# Altium project GPSDO.PrjPcb
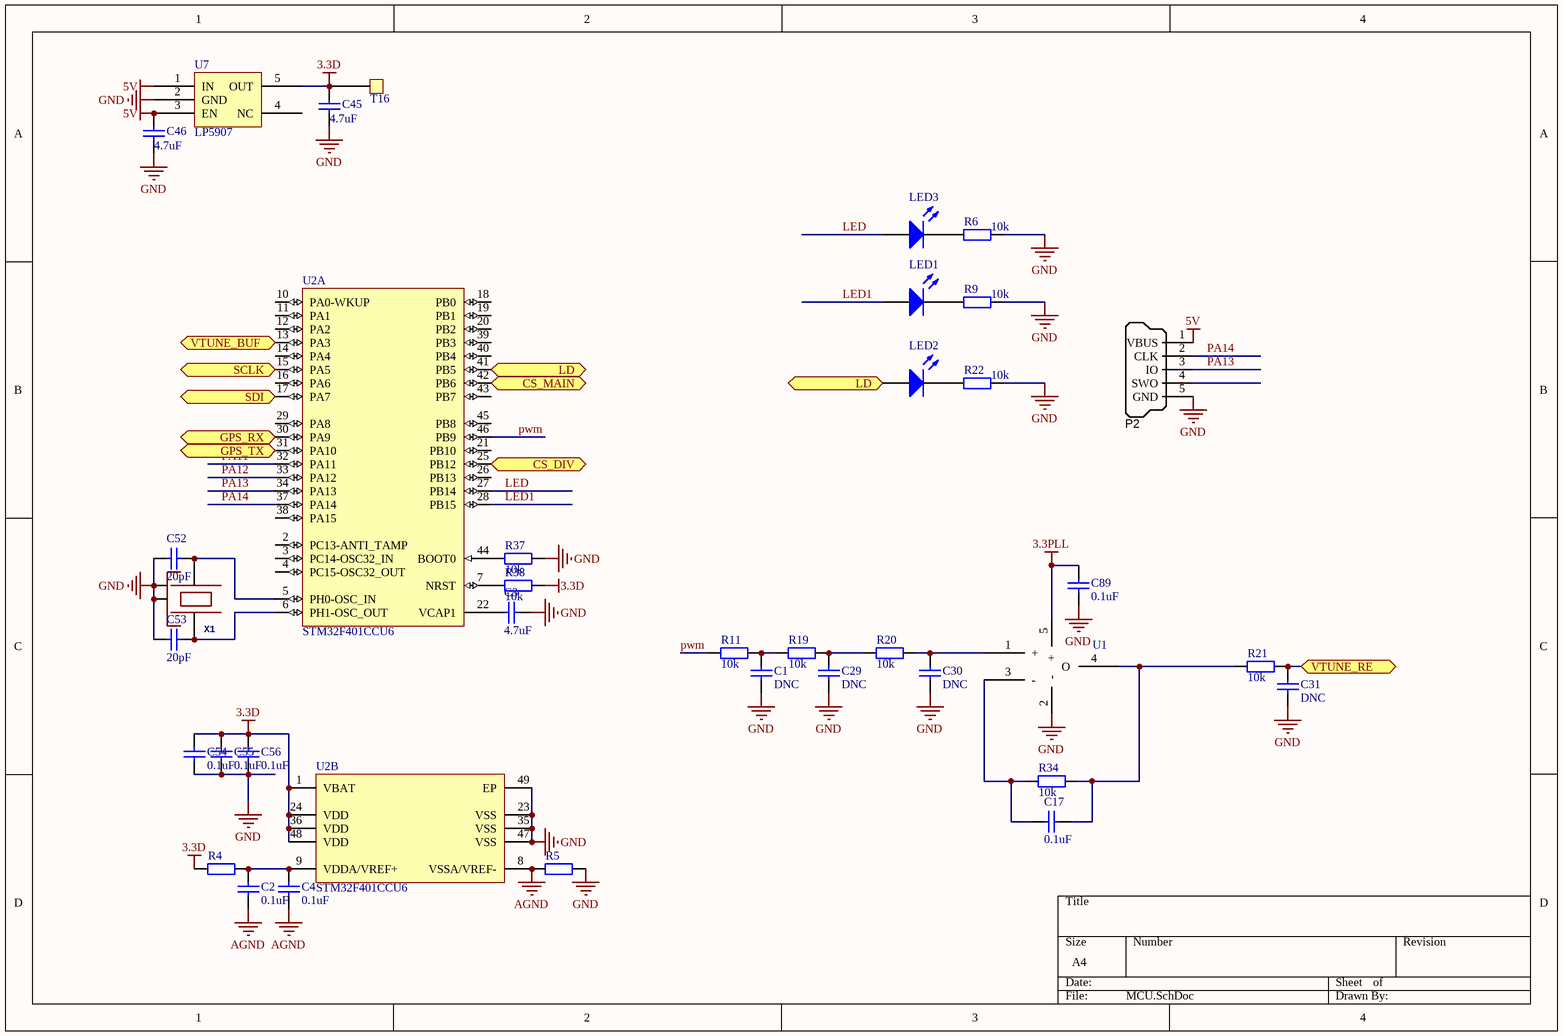
[diagram p0: MCU.SchDoc]
3 sheets, 90 parts. Net scope: flat (ports and power ports of the same name join across sheets).
Board file: GPSDO.PcbDoc
Sheets:
  MCU.SchDoc
  GPS.SchDoc
  PLL.SchDoc

## Sheet MCU.SchDoc
size A4

### Parts
C1  value DNC  [0402]  (hidden comment: Cap)
C2  value 0.1uF  [0402]  (hidden comment: Cap)
C3  value 4.7uF  [0603]  (hidden comment: Cap)
C4  value 0.1uF  [0402]  (hidden comment: Cap)
C17  value 0.1uF  [0402]  (hidden comment: Cap)
C29  value DNC  [0402]  (hidden comment: Cap)
C30  value DNC  [0402]  (hidden comment: Cap)
C31  value DNC  [0402]  (hidden comment: Cap)
C45  4.7uF  [0603]
C46  4.7uF  [0603]
C52  value 20pF  [0402]  (hidden comment: Cap)
C53  value 20pF  [0402]  (hidden comment: Cap)
C54  value 0.1uF  [0402]  (hidden comment: Cap)
C55  value 0.1uF  [0402]  (hidden comment: Cap)
C56  value 0.1uF  [0402]  (hidden comment: Cap)
C89  value 0.1uF  [0402]  (hidden comment: Cap)
LED1  LED0  [0603]  (value not drawn)
LED2  LED0  [0603]  (value not drawn)
LED3  LED0  [0603]  (value not drawn)
P2  SWD_MicroUSB  [MICRO-YZX]  (value not drawn)
R4  0R/FB  [0402]  (value not drawn)
R5  0R/FB  [0402]  (value not drawn)
R6  10k  [0402]
R9  10k  [0402]
R11  value 10k  [0402]  (hidden comment: Res2)
R19  value 10k  [0402]  (hidden comment: Res2)
R20  value 10k  [0402]  (hidden comment: Res2)
R21  value 10k  [0402]  (hidden comment: Res2)
R22  10k  [0402]
R34  value 10k  [0402]  (hidden comment: Res2)
R37  value 10k  [0402]  (hidden comment: Res2)
R38  value 10k  [0402]  (hidden comment: Res2)
T16  TestPad  [TestPad - 1mm]  (value not drawn)
U1  OP-SOT23  [SOT23-5]  (value not drawn)
U2  STM32F401CCU6  [STM-UFQFPN48_N]  (parts A,B of 2)
U7  LP5907  [SOT23-5]
X1  24.000 KHz 3.2x2.5mm 8-10pf  [OSCILLATOR-3.2X2.5]  (value not drawn)

### Ports
CS_DIV, CS_MAIN, GPS_RX, GPS_TX, LD, SCLK, SDI, VTUNE_BUF, VTUNE_RE

### Nets
3.3D: C45.2 C54.2 C55.2 C56.2 R4.2 R38.1 T16.1 U2.1(VBAT) U2.24(VDD) U2.36(VDD) U2.48(VDD) U7.5(OUT)
3.3PLL: C89.2 U1.5(+)
5V: C46.2 P2.1(VBUS) U7.1(IN) U7.3(EN)
AGND: C2.1 C4.1 R5.2 U2.8(VSSA/VREF-)
GND: C1.2 C3.1 C29.2 C30.2 C31.2 C45.1 C46.1 C52.1 C53.1 C54.1 C55.1 C56.1 C89.1 P2.5(GND) R5.1 R6.2 R9.2 R22.2 R37.2 U1.2(-) U2.23(VSS) U2.35(VSS) U2.47(VSS) U2.49(EP) U7.2(GND) X1.2(NC_2) X1.4(NC_4)
LED: LED3.1(A) U2.27(PB14)
LED1: LED1.1(A) U2.28(PB15)
PA11: U2.32(PA11)
PA12: U2.33(PA12)
PA13: P2.3(IO) U2.34(PA13)
PA14: P2.2(CLK) U2.37(PA14)
pwm: R11.2 U2.46(PB9)
NetC1_1: C1.1 R11.1 R19.2
NetC2_2: C2.2 C4.2 R4.1 U2.9(VDDA/VREF+)
NetC3_2: C3.2 U2.22(VCAP1)
NetC17_1: C17.1 R34.2 U1.3(-)
NetC17_2: C17.2 R21.2 R34.1 U1.4(O)
NetC19_1: C31.1 R21.1 ; port VTUNE_RE
NetC28_2: U2.13(PA3) ; port VTUNE_BUF
NetC29_1: C29.1 R19.1 R20.2
NetC30_1: C30.1 R20.1 U1.1(+)
NetC52_2: C52.2 U2.5(PH0-OSC_IN) X1.1
NetC53_2: C53.2 U2.6(PH1-OSC_OUT) X1.3
NetLED1_2: LED1.2(K) R9.1
NetLED2_1: LED2.1(A) U2.41(PB5) ; port LD
NetLED2_2: LED2.2(K) R22.1
NetLED3_2: LED3.2(K) R6.1
NetR37_1: R37.1 U2.44(BOOT0)
NetR38_2: R38.2 U2.7(NRST)
NetU2_15: U2.15(PA5) ; port SCLK
NetU2_17: U2.17(PA7) ; port SDI
NetU2_25: U2.25(PB12) ; port CS_DIV
NetU2_30: U2.30(PA9) ; port GPS_RX
NetU2_31: U2.31(PA10) ; port GPS_TX
NetU2_42: U2.42(PB6) ; port CS_MAIN

Not connected (* = marked no-connect by the designer): P2 4(SWO); U2 2(PC13-ANTI_TAMP) 3(PC14-OSC32_IN) 4(PC15-OSC32_OUT) 10(PA0-WKUP) 11(PA1) 12(PA2) 14(PA4) 16(PA6) 18(PB0) 19(PB1) 20(PB2) 21(PB10) 26(PB13) 29(PA8) 38(PA15) 39(PB3) 40(PB4) 43(PB7) 45(PB8); U7 4(NC)

### Library data of the parts
C1-C4 C17 C29-C31 C45 C46 C52-C56 C89 = Cap: Capacitor; Published: 8-Jun-2000; LatestRevisionDate: 17-Jul-2002; LatestRevisionNote: Re-released for DXP Platform.; PackageReference: RAD-0.3; Publisher: Altium Limited; PackageDescription: Radial Cap, Thru-Hole; 2 Leads; 0.3 in Pin Spacing
LED1-LED3 = LED0: Typical INFRARED GaAs LED; Published: 8-Jun-2000; LatestRevisionDate: 08-Jul-2005; LatestRevisionNote: Mech Layer 1 removed.; PackageReference: LED-0; Publisher: Altium Limited; PackageDescription: LED; 2 Leads
P2 = SWD_MicroUSB: Connector SMD USB Micro Type B middle mount; Manufacturer 1: Molex Inc; SCDType: undef; Package / Case: SMD; Supplier 1: Digi-Key; Supplier Part Number 1: WM17142CT-ND
R4 R5 R11 R19-R21 R34 R37 R38 = Res2: Resistor; Published: 8-Jun-2000; LatestRevisionDate: 17-Jul-2002; LatestRevisionNote: Re-released for DXP Platform.; PackageReference: AXIAL-0.4; Publisher: Altium Limited; PackageDescription: Axial Device, Thru-Hole; 2 Leads; 0.4 in Pin Spacing
R6 R9 R22 = Res2: Resistor; Value: 0Ohm; Published: 8-Jun-2000; LatestRevisionDate: 17-Jul-2002; LatestRevisionNote: Re-released for DXP Platform.; PackageReference: AXIAL-0.4; Publisher: Altium Limited; PackageDescription: Axial Device, Thru-Hole; 2 Leads; 0.4 in Pin Spacing
U2 = STM32F401CCU6: ARM Cortex-M4 32-bit MCU+FPU, 105 DMIPS, 256 kB Flash, 64 kB Internal RAM, 36 I/Os, 48-pin UFQFPN, -40 to 85 degC, Tray; Manufacturer: STMicroelectronics; FLASH Size (Prog) (kB): 256; I/Os (High Current): 36; Internal RAM Size (kB): 64; Operating Frequency(F) (Processor speed) (MHz): 84; Supply Voltage(Vcc) max (V): 3.6; Supply Voltage(Vcc) min (V): 1.8; DatasheetVersion: Rev. 1; PackageVersion: Rev. 1, 04/2013; PackageReference: UFQFPN48; PackageDescription: 48-Pin Ultra Thin Fine Pitch Quad Flat No-Lead, 7 x 7 x 0.6 mm Body, 0.5 mm Pitch, Exposed Pad; Supplier 1: Newark; Supplier Part Number 1: 19X6217; Supplier 2: Mouser; Supplier Part Number 2: 511-STM32F401CCU6; Core: ARM Cortex-M4; Packing: Tray; Mounting Technology: Surface Mount; PartNumber: STM32F401CCU6; ComponentLink1Description: Manufacturer URL; ComponentLink1URL: http://www.st.com/web/en/home.html; ComponentLink2Description: Datasheet; ComponentLink2URL: http://www.st.com/st-web-ui/static/active/en/resource/technical/document/data_brief/DM00071938.pdf; ComponentLink3Description: Package Specification; ComponentLink3URL: http://www.st.com/st-web-ui/static/active/en/resource/technical/document/data_brief/DM00071938.pdf
X1 = OSCILLATOR-3.2X2.5: Crystal Oscillator in 3.2x2.5 SMD

## Sheet GPS.SchDoc
size A4
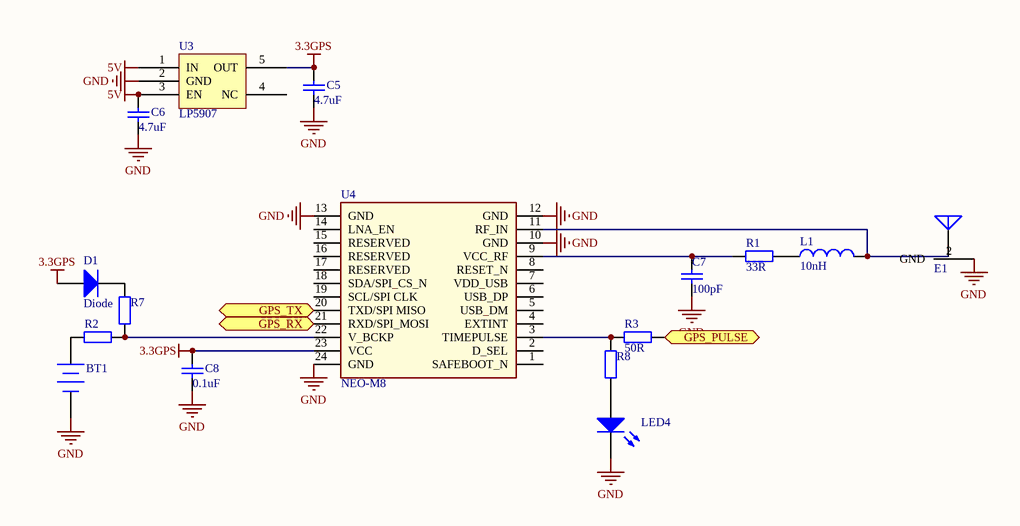
[diagram p1: GPS.SchDoc]

### Parts
BT1  Battery  [XH414H-IV01E]  (value not drawn)
C5  4.7uF  [0603]
C6  4.7uF  [0603]
C7  100pF  [0402]
C8  0.1uF  [0402]
D1  Diode  [LC-SOD-323]
E1  Antenna  [IPEX]  (value not drawn)
L1  10nH  [0402]
LED4  LED0  [0603]  (value not drawn)
R1  33R  [0402]
R2  (no value)  [0402]
R3  50R  [0402]
R7  (no value)  [0402]
R8  (no value)  [0402]
U3  LP5907  [SOT23-5]
U4  NEO-M8  [NEO]

### Ports
GPS_PULSE, GPS_RX, GPS_TX

### Nets
3.3GPS: C5.2 C8.2 D1.1(A) U3.5(OUT) U4.23(VCC)
5V: C6.2 U3.1(IN) U3.3(EN)
GND: BT1.2(-) C5.1 C6.1 C7.1 C8.1 E1.2(GND) LED4.2(K) U3.2(GND) U4.10(GND) U4.12(GND) U4.13(GND) U4.24(GND)
NetBT1_1: BT1.1(+) R2.1
NetC7_2: C7.2 R1.1 U4.9(VCC_RF)
NetC14_1: R3.1 ; port GPS_PULSE
NetD1_2: D1.2(K) R7.1
NetE1_1: E1.1(ANT) L1.2 U4.11(RF_IN)
NetL1_1: L1.1 R1.2
NetLED4_1: LED4.1(A) R8.2
NetR2_2: R2.2 R7.2 U4.22(V_BCKP)
NetR3_2: R3.2 R8.1 U4.3(TIMEPULSE)
NetU2_30: U4.21(RXD/SPI_MOSI) ; port GPS_RX
NetU2_31: U4.20(TXD/SPI_MISO) ; port GPS_TX

Not connected (* = marked no-connect by the designer): U3 4(NC); U4 1(SAFEBOOT_N) 2(D_SEL) 4(EXTINT) 5(USB_DM) 6(USB_DP) 7(VDD_USB) 8(RESET_N) 14(LNA_EN) 15(RESERVED) 16(RESERVED) 17(RESERVED) 18(SDA/SPI_CS_N) 19(SCL/SPI_CLK)

### Library data of the parts
BT1 = Battery: Multicell Battery; Published: 24-Mar-1999; LatestRevisionDate: 17-Jul-2002; LatestRevisionNote: Re-released for DXP Platform.; PackageReference: BAT-2; Publisher: Altium Limited; PackageDescription: Battery; 2 Leads
C5-C8 = Cap: Capacitor; Published: 8-Jun-2000; LatestRevisionDate: 17-Jul-2002; LatestRevisionNote: Re-released for DXP Platform.; PackageReference: RAD-0.3; Publisher: Altium Limited; PackageDescription: Radial Cap, Thru-Hole; 2 Leads; 0.3 in Pin Spacing
D1 = Diode: Default Diode; Published: 8-Jun-2000; LatestRevisionDate: 17-Jul-2002; LatestRevisionNote: Re-released for DXP Platform.; PackageVersion: Sep-1996; PackageReference: SMC; Publisher: Altium Limited; PackageDescription: DO-214-AB/SMC; 2 C-Bend Leads; Body 7.9 x 5.9 mm, inc. leads (LxW); Code_JEDEC: DO-214-AB
E1 = Antenna: Generic Antenna; Published: 24-Mar-1999; LatestRevisionDate: 17-Jul-2002; LatestRevisionNote: Re-released for DXP Platform.; PackageReference: PIN1; Publisher: Altium Limited
L1 = Inductor: Code_IEC: 1005; Value: 10mH; Published: 8-Jun-2000; LatestRevisionDate: 29-May-2009; LatestRevisionNote: IPC-7351 Footprint Added.; PackageReference: 0402-A; Publisher: Altium Limited; PackageDescription: Chip Inductor; Code_JEITA: 0402
LED4 = LED0: Typical INFRARED GaAs LED; Published: 8-Jun-2000; LatestRevisionDate: 08-Jul-2005; LatestRevisionNote: Mech Layer 1 removed.; PackageReference: LED-0; Publisher: Altium Limited; PackageDescription: LED; 2 Leads
R1 R3 = Res2: Resistor; Published: 8-Jun-2000; LatestRevisionDate: 17-Jul-2002; LatestRevisionNote: Re-released for DXP Platform.; PackageReference: AXIAL-0.4; Publisher: Altium Limited; PackageDescription: Axial Device, Thru-Hole; 2 Leads; 0.4 in Pin Spacing
R2 R7 R8 = Res2: Resistor; Value: 0R; Published: 8-Jun-2000; LatestRevisionDate: 17-Jul-2002; LatestRevisionNote: Re-released for DXP Platform.; PackageReference: AXIAL-0.4; Publisher: Altium Limited; PackageDescription: Axial Device, Thru-Hole; 2 Leads; 0.4 in Pin Spacing
U4 = NEO: u-blox NEO GNSS module; Part Description: u-blox GNSS module; Manufacturer: u-blox; Value: NEO-M8

## Sheet PLL.SchDoc
size A4
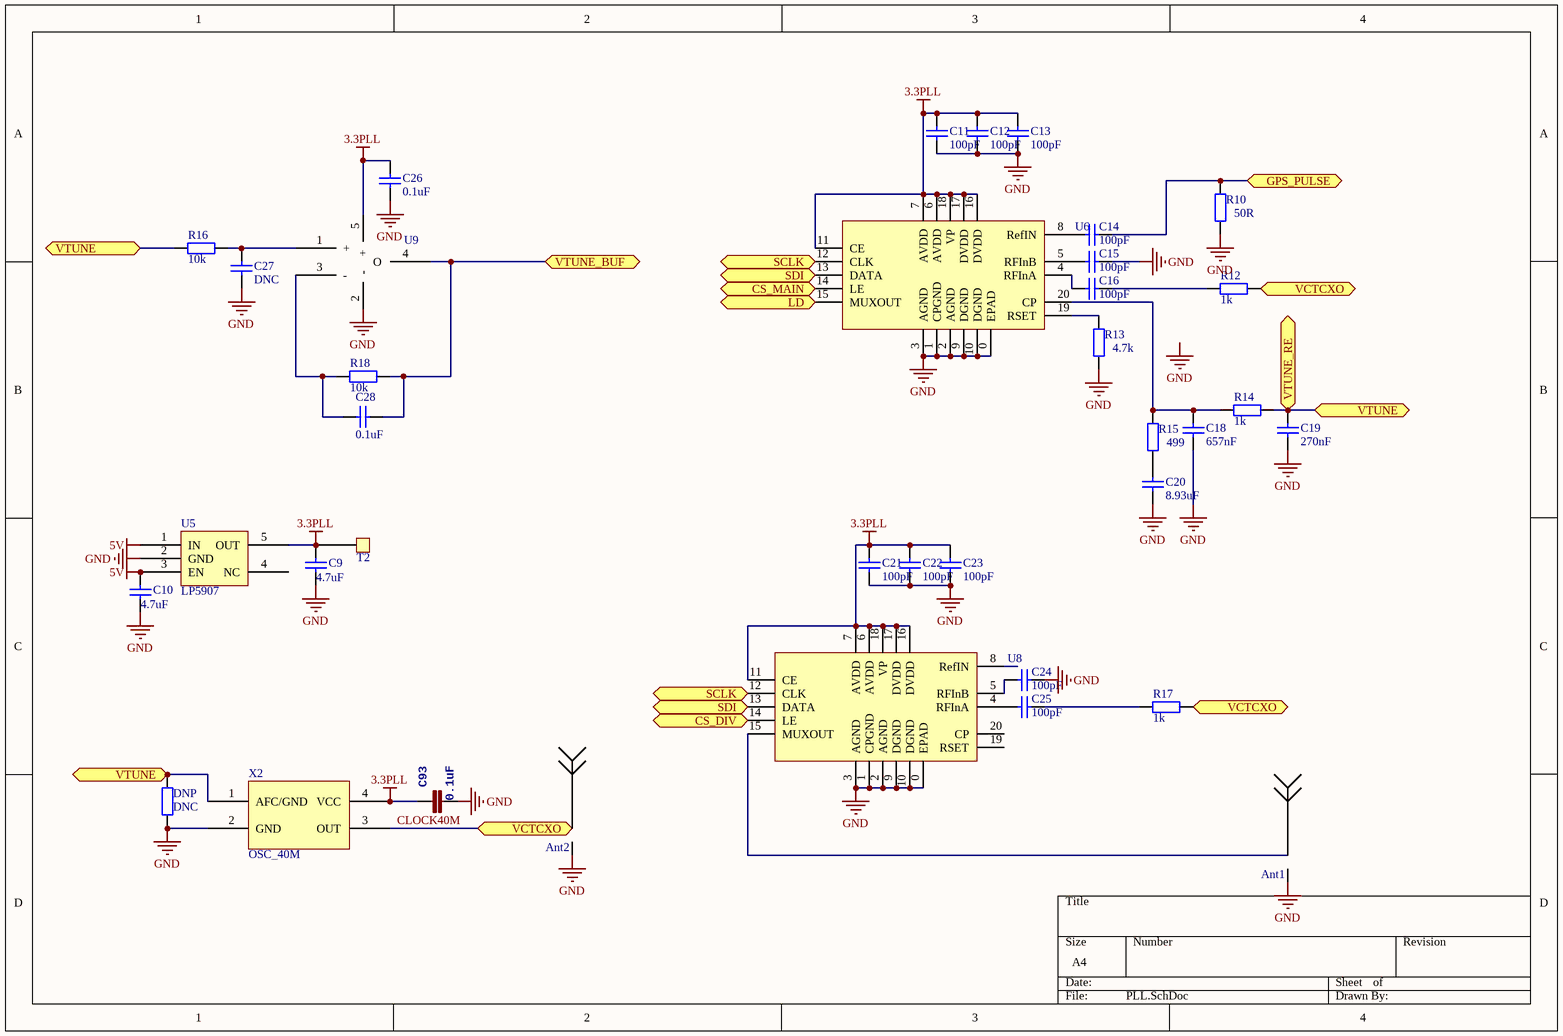
[diagram p2: PLL.SchDoc]

### Parts
Ant1  Antenna  [SMA-2]  (value not drawn)
Ant2  Antenna  [SMA-2]  (value not drawn)
C9  4.7uF  [0603]
C10  4.7uF  [0603]
C11  100pF  [0402]
C12  100pF  [0402]
C13  100pF  [0402]
C14  100pF  [0402]
C15  100pF  [0402]
C16  100pF  [0402]
C18  657nF  [0402]
C19  270nF  [0402]
C20  8.93uF  [0402]
C21  100pF  [0402]
C22  100pF  [0402]
C23  100pF  [0402]
C24  100pF  [0402]
C25  100pF  [0402]
C26  value 0.1uF  [0402]  (hidden comment: Cap)
C27  value DNC  [0402]  (hidden comment: Cap)
C28  value 0.1uF  [0402]  (hidden comment: Cap)
C93  0.1uF  [0402]
DNP  DNC  [0402]
R10  50R  [0402]
R12  1k  [0402]
R13  4.7k  [0402]
R14  1k  [0402]
R15  499  [0402]
R16  value 10k  [0402]  (hidden comment: Res2)
R17  1k  [0402]
R18  value 10k  [0402]  (hidden comment: Res2)
T2  TestPad  [TestPad - 1mm]  (value not drawn)
U5  LP5907  [SOT23-5]
U6  ADF4001  [ADF4001]  (value not drawn)
U8  ADF4001  [ADF4001]  (value not drawn)
U9  OP-SOT23  [SOT23-5]  (value not drawn)
X2  OSC_40M  [TXC_7Q]

### Ports
CS_DIV, CS_MAIN, GPS_PULSE, LD, SCLK, SDI, VCTCXO, VTUNE, VTUNE_BUF, VTUNE_RE

### Nets
3.3PLL: C9.2 C11.1 C12.1 C13.1 C21.1 C22.1 C23.1 C26.2 C93.1 T2.1 U5.5(OUT) U6.6(AVDD) U6.7(AVDD) U6.11(CE) U6.16(DVDD) U6.17(DVDD) U6.18(VP) U8.6(AVDD) U8.7(AVDD) U8.11(CE) U8.16(DVDD) U8.17(DVDD) U8.18(VP) U9.5(+) X2.4(VCC)
5V: C10.2 U5.1(IN) U5.3(EN)
GND: Ant1.GND(G) Ant2.GND(G) C9.1 C10.1 C11.2 C12.2 C13.2 C15.1 C18.2 C19.2 C20.2 C21.2 C22.2 C23.2 C24.1 C26.1 C27.2 C93.2 DNP.2 R10.1 R13.1 U5.2(GND) U6.0(EPAD) U6.1(CPGND) U6.2(AGND) U6.3(AGND) U6.9(DGND) U6.10(DGND) U8.0(EPAD) U8.1(CPGND) U8.2(AGND) U8.3(AGND) U8.9(DGND) U8.10(DGND) U9.2(-) X2.2(GND)
CLOCK40M: Ant2.1 R12.1 R17.1 X2.3(OUT) ; port VCTCXO
NetAnt1_1: Ant1.1 U8.15(MUXOUT)
NetC14_1: C14.1 R10.2 ; port GPS_PULSE
NetC14_2: C14.2 U6.8(RefIN)
NetC15_2: C15.2 U6.5(RFInB)
NetC16_1: C16.1 R12.2
NetC16_2: C16.2 U6.4(RFInA)
NetC18_1: C18.1 R14.2 R15.2 U6.20(CP)
NetC19_1: C19.1 DNP.1 R14.1 R16.2 X2.1(AFC/GND) ; port VTUNE, port VTUNE_RE
NetC20_1: C20.1 R15.1
NetC24_2: C24.2 U8.5(RFInB)
NetC25_1: C25.1 R17.2
NetC25_2: C25.2 U8.4(RFInA)
NetC27_1: C27.1 R16.1 U9.1(+)
NetC28_1: C28.1 R18.2 U9.3(-)
NetC28_2: C28.2 R18.1 U9.4(O) ; port VTUNE_BUF
NetLED2_1: U6.15(MUXOUT) ; port LD
NetR13_2: R13.2 U6.19(RSET)
NetU2_15: U6.12(CLK) U8.12(CLK) ; port SCLK
NetU2_17: U6.13(DATA) U8.13(DATA) ; port SDI
NetU2_25: U8.14(LE) ; port CS_DIV
NetU2_42: U6.14(LE) ; port CS_MAIN

Not connected (* = marked no-connect by the designer): U5 4(NC); U8 8(RefIN) 19(RSET) 20(CP)

### Notes on the sheet
- Labels drawn without touching a wire or pin: GND

### Library data of the parts
C9-C16 C18-C28 = Cap: Capacitor; Published: 8-Jun-2000; LatestRevisionDate: 17-Jul-2002; LatestRevisionNote: Re-released for DXP Platform.; PackageReference: RAD-0.3; Publisher: Altium Limited; PackageDescription: Radial Cap, Thru-Hole; 2 Leads; 0.3 in Pin Spacing
C93 = CAP0402-CAP: <b>Capacitor</b> / Standard 0603 ceramic capacitor, and 0.1" leaded capacitor.; PARTNO: CC0402ZRY5V7BB104
DNP = Res2: Resistor; Value: 0Ohm; Published: 8-Jun-2000; LatestRevisionDate: 17-Jul-2002; LatestRevisionNote: Re-released for DXP Platform.; PackageReference: AXIAL-0.4; Publisher: Altium Limited; PackageDescription: Axial Device, Thru-Hole; 2 Leads; 0.4 in Pin Spacing
R10 R12-R18 = Res2: Resistor; Published: 8-Jun-2000; LatestRevisionDate: 17-Jul-2002; LatestRevisionNote: Re-released for DXP Platform.; PackageReference: AXIAL-0.4; Publisher: Altium Limited; PackageDescription: Axial Device, Thru-Hole; 2 Leads; 0.4 in Pin Spacing

## Nets that join several sheets
3.3PLL: MCU (C89.2 U1.5), PLL (25 pins)
5V: MCU (C46.2 P2.1 U7.1 U7.3), GPS (C6.2 U3.1 U3.3), PLL (C10.2 U5.1 U5.3)
GND: MCU (27 pins), GPS (12 pins), PLL (36 pins)
NetC14_1: GPS (R3.1), PLL (C14.1 R10.2)
NetC19_1: MCU (C31.1 R21.1), PLL (5 pins)
NetC28_2: MCU (U2.13), PLL (C28.2 R18.1 U9.4)
NetLED2_1: MCU (LED2.1 U2.41), PLL (U6.15)
NetU2_15: MCU (U2.15), PLL (U6.12 U8.12)
NetU2_17: MCU (U2.17), PLL (U6.13 U8.13)
NetU2_25: MCU (U2.25), PLL (U8.14)
NetU2_30: MCU (U2.30), GPS (U4.21)
NetU2_31: MCU (U2.31), GPS (U4.20)
NetU2_42: MCU (U2.42), PLL (U6.14)